# Altium schematic sheet RP2040.SchDoc
size A3; SheetNumber: 9; SheetTotal: 13; SPICEModelCacheJQUAOKPN: <root> / <DocumentId>JQUAOKPN</DocumentId> / <CacheFrame Number="0"> / <Model Name="0402_885012205086_100nf" Kind="CKT"> / <Text>******* / .subckt 0402_885012205086_100nF 1 2 / Rser 1 3 0.07 / Lser 2 4 0.00000000055 / C1 3 4 0.0000001 / Rpar 3 4 1000000000 / .ends 0402_885012205086_100nF</Text> / </Model> / </CacheFrame> / </root>
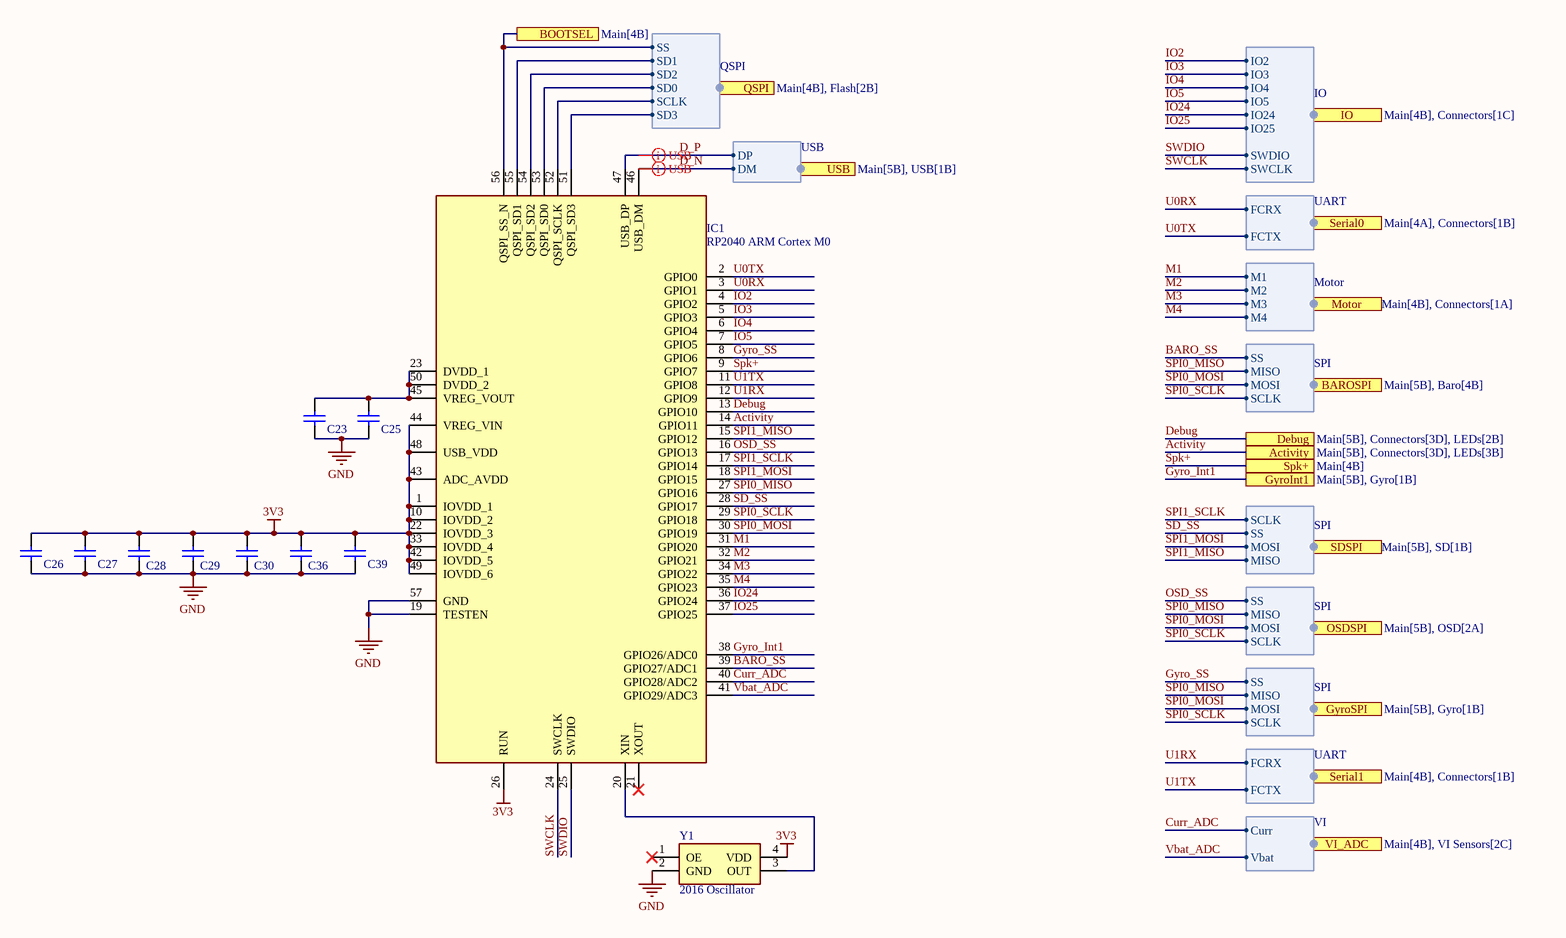
[diagram p0: RP2040.SchDoc]

## Parts
C23  100nF  [WCAP-CSGP_0402_L1W0.5H0.5]  (value not drawn)
C25  100nF  [WCAP-CSGP_0402_L1W0.5H0.5]  (value not drawn)
C26  100nF  [WCAP-CSGP_0402_L1W0.5H0.5]  (value not drawn)
C27  100nF  [WCAP-CSGP_0402_L1W0.5H0.5]  (value not drawn)
C28  100nF  [WCAP-CSGP_0603_L1.6W0.8H0.8_Reflow]  (value not drawn)
C29  100nF  [WCAP-CSGP_0603_L1.6W0.8H0.8_Reflow]  (value not drawn)
C30  100nF  [WCAP-CSGP_0603_L1.6W0.8H0.8_Reflow]  (value not drawn)
C36  100nF  [WCAP-CSGP_0603_L1.6W0.8H0.8_Reflow]  (value not drawn)
C39  100nF  [WCAP-CSGP_0402_L1W0.5H0.5]  (value not drawn)
IC1  RP2040 ARM Cortex M0  [SC091413]
Y1  2016 Oscillator  [2016 Oscillator]

## Ports
Activity (see Main[5B], Connectors[3D], LEDs[3B]), BAROSPI (harness SPI, see Main[5B], Baro[4B]), BOOTSEL (see Main[4B]), Debug (see Main[5B], Connectors[3D], LEDs[2B]), GyroInt1 (see Main[5B], Gyro[1B]), GyroSPI (harness SPI, see Main[5B], Gyro[1B]), IO (harness IO, see Main[4B], Connectors[1C]), Motor (harness Motor, see Main[4B], Connectors[1A]), OSDSPI (harness SPI, see Main[5B], OSD[2A]), QSPI (harness QSPI, see Main[4B], Flash[2B]), SDSPI (harness SPI, see Main[5B], SD[1B]), Serial0 (harness UART, see Main[4A], Connectors[1B]), Serial1 (harness UART, see Main[4B], Connectors[1B]), Spk+ (see Main[4B]), USB (harness USB, see Main[5B], USB[1B]), VI_ADC (harness VI, see Main[4B], VI Sensors[2C])

## Harnesses
QSPI: SS, SD1, SD2, SD0, SCLK, SD3
USB: DP, DM
SPI: SS, MISO, MOSI, SCLK
UART: FCRX, FCTX
Motor: M2, M4, M1, M3
VI: Curr, Vbat
IO: IO24, IO25, SWDIO, SWCLK, IO4, IO5, IO3, IO2
SPI: MISO, MOSI, SS, SCLK

## Nets
3V3: C26.2 C27.2 C28.2 C29.2 C30.2 C36.2 C39.2 IC1.1(IOVDD_1) IC1.10(IOVDD_2) IC1.22(IOVDD_3) IC1.26(RUN) IC1.33(IOVDD_4) IC1.42(IOVDD_5) IC1.43(ADC_AVDD) IC1.44(VREG_VIN) IC1.48(USB_VDD) IC1.49(IOVDD_6) Y1.4(VDD)
GND: C23.1 C25.1 C26.1 C27.1 C28.1 C29.1 C30.1 C36.1 C39.1 IC1.19(TESTEN) IC1.57(GND) Y1.2(GND)
Activity: IC1.14(GPIO11) ; port Activity
BARO_SS: IC1.39(GPIO27/ADC1) ; port BAROSPI.SS
BOOTSEL: IC1.56(QSPI_SS_N) ; port BOOTSEL, port QSPI.SS
Curr_ADC: IC1.40(GPIO28/ADC2) ; port VI_ADC.Curr
D_N: IC1.46(USB_DM) ; port USB.DM
D_P: IC1.47(USB_DP) ; port USB.DP
Debug: IC1.13(GPIO10) ; port Debug
Gyro_Int1: IC1.38(GPIO26/ADC0) ; port GyroInt1
Gyro_SS: IC1.8(GPIO6) ; port GyroSPI.SS
IO2: IC1.4(GPIO2) ; port IO.IO2
IO3: IC1.5(GPIO3) ; port IO.IO3
IO4: IC1.6(GPIO4) ; port IO.IO4
IO5: IC1.7(GPIO5) ; port IO.IO5
IO24: IC1.36(GPIO24) ; port IO.IO24
IO25: IC1.37(GPIO25) ; port IO.IO25
M1: IC1.31(GPIO20) ; port Motor.M1
M2: IC1.32(GPIO21) ; port Motor.M2
M3: IC1.34(GPIO22) ; port Motor.M3
M4: IC1.35(GPIO23) ; port Motor.M4
OSD_SS: IC1.16(GPIO13) ; port OSDSPI.SS
SD_SS: IC1.28(GPIO17) ; port SDSPI.SS
SPI0_MISO: IC1.27(GPIO16) ; port BAROSPI.MISO, port OSDSPI.MISO, port GyroSPI.MISO
SPI0_MOSI: IC1.30(GPIO19) ; port BAROSPI.MOSI, port OSDSPI.MOSI, port GyroSPI.MOSI
SPI0_SCLK: IC1.29(GPIO18) ; port BAROSPI.SCLK, port OSDSPI.SCLK, port GyroSPI.SCLK
SPI1_MISO: IC1.15(GPIO12) ; port SDSPI.MISO
SPI1_MOSI: IC1.18(GPIO15) ; port SDSPI.MOSI
SPI1_SCLK: IC1.17(GPIO14) ; port SDSPI.SCLK
Spk+: IC1.9(GPIO7) ; port Spk+
SWCLK: IC1.24(SWCLK) ; port IO.SWCLK
SWDIO: IC1.25(SWDIO) ; port IO.SWDIO
U0RX: IC1.3(GPIO1) ; port Serial0.FCRX
U0TX: IC1.2(GPIO0) ; port Serial0.FCTX
U1RX: IC1.12(GPIO9) ; port Serial1.FCRX
U1TX: IC1.11(GPIO8) ; port Serial1.FCTX
Vbat_ADC: IC1.41(GPIO29/ADC3) ; port VI_ADC.Vbat
NetC23_2: C23.2 C25.2 IC1.23(DVDD_1) IC1.45(VREG_VOUT) IC1.50(DVDD_2)
NetIC1_20: IC1.20(XIN) Y1.3(OUT)
NetIC1_51: IC1.51(QSPI_SD3) ; port QSPI.SD3
NetIC1_52: IC1.52(QSPI_SCLK) ; port QSPI.SCLK
NetIC1_53: IC1.53(QSPI_SD0) ; port QSPI.SD0
NetIC1_54: IC1.54(QSPI_SD2) ; port QSPI.SD2
NetIC1_55: IC1.55(QSPI_SD1) ; port QSPI.SD1

Not connected (* = marked no-connect by the designer): IC1 21(XOUT)*; Y1 1(OE)*

## Layout directives
differential pair: D_N, D_P

## Library data of the parts
C23 C25-C27 C39 = 885012205086: WCAP-CSGP Multilayer Ceramic Chip Capacitor, General Purpose, size 0402, X7R, 100nF, 50VDC; Manufacturer: Wurth Elektronik; Case/Size Code: 0402; Capacitance Tolerance: +/-10%; Dissipation Factor: 10%; Insulation Resistance: 0.5GΩ; Rated Voltage (DC): 50V; Technical Reference: X7R0402104K050DFCT10000; Manufacturer Part Number: 885012205086; Category: Multilayer Ceramic Chip Capacitors; Match Code: WCAP-CSGP; ComponentLink1Description: Website Link; ComponentLink1URL: https://www.we-online.com/redexpert/article/885012205086?ad; ComponentLink2Description: Datasheet Link; ComponentLink2URL: https://www.we-online.com/redexpert/spec/885012205086?ad; Mount: Surface Mount; Operating Temperature Max: 125°C; Operating Temperature Min: -55°C; Packaging: Tape and Reel; Length: 1mm; Width: 0.5mm; Height: 0.5mm; Capacitance: 100nF; Ceramic Type: X7R
C28-C30 C36 = 885012206095: WCAP-CSGP Multilayer Ceramic Chip Capacitor, General Purpose, size 0603, X7R, 100nF, 50VDC; Manufacturer: Wurth Elektronik; Case/Size Code: 0603; Capacitance Tolerance: +/-10%; Dissipation Factor: 3%; Insulation Resistance: 5GΩ; Rated Voltage (DC): 50V; Technical Reference: X7R0603104K050DFCT10000; Manufacturer Part Number: 885012206095; Category: Multilayer Ceramic Chip Capacitors; Match Code: WCAP-CSGP; ComponentLink1Description: Website Link; ComponentLink1URL: https://www.we-online.com/redexpert/article/885012206095?ad; ComponentLink2Description: Datasheet Link; ComponentLink2URL: https://www.we-online.com/redexpert/spec/885012206095?ad; Mount: Surface Mount; Operating Temperature Max: 125°C; Operating Temperature Min: -55°C; Packaging: Tape and Reel; Length: 1.6mm; Width: 0.8mm; Height: 0.8mm; Capacitance: 100nF; Ceramic Type: X7R
IC1 = RP2040: Microcontroller; Manufacturer_Name: RASPBERRY-PI; Manufacturer_Part_Number: SC0914(13); Datasheet Link: https://datasheets.raspberrypi.com/rp2040/rp2040-datasheet.pdf; Height: 0.9mm; Mouser Part Number: 358-SC091413; Mouser Price/Stock: https://www.mouser.co.uk/ProductDetail/Raspberry-Pi/SC091413?qs=T%252BzbugeAwjhr%252BUbBr3TJcw%3D%3D
Y1 = 2016 Oscillator: YXC OT201612MJBA4SL; Manufacturer_Name: Microchip; Manufacturer_Part_Number: DSC6003MA3B-032K768; Datasheet Link: https://www.mouser.es/datasheet/2/268/DSC60xxB-Ultra-Small-Ultra-Low-Power-MEMS-Oscillat-1660527.pdf; Height: 0.89mm; Mouser Part Number: 579-6003MA3B032K768; Mouser Price/Stock: https://www.mouser.co.uk/ProductDetail/Microchip-Technology/DSC6003MA3B-032K768?qs=PqoDHHvF64%252BWTEYTiC%2Fvdw%3D%3D